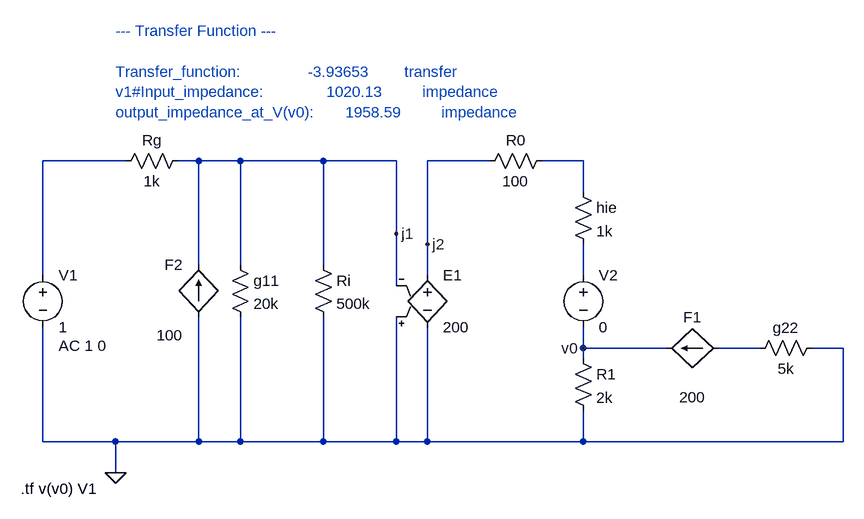
[diagram p0: schematic eje2_sim.asc]
eje2_sim.asc, the LTspice schematic file:
Version 4
SHEET 1 888 696
WIRE -240 176 -368 176
WIRE -128 176 -160 176
WIRE -64 176 -128 176
WIRE 64 176 -64 176
WIRE 176 176 64 176
WIRE 320 176 224 176
WIRE 464 176 400 176
WIRE 464 224 464 176
WIRE 176 288 176 176
WIRE 224 304 224 176
WIRE -128 336 -128 176
WIRE -64 336 -64 176
WIRE 64 336 64 176
WIRE -368 352 -368 176
WIRE 224 352 224 304
WIRE 464 352 464 304
WIRE 176 368 176 288
WIRE 464 464 464 432
WIRE 592 464 464 464
WIRE 736 464 672 464
WIRE 864 464 816 464
WIRE 464 480 464 464
WIRE -368 608 -368 432
WIRE -256 608 -368 608
WIRE -128 608 -128 416
WIRE -128 608 -256 608
WIRE -64 608 -64 416
WIRE -64 608 -128 608
WIRE 64 608 64 416
WIRE 64 608 -64 608
WIRE 176 608 176 416
WIRE 176 608 64 608
WIRE 224 608 224 432
WIRE 224 608 176 608
WIRE 464 608 464 560
WIRE 464 608 224 608
WIRE 864 608 864 464
WIRE 864 608 464 608
WIRE -256 656 -256 608
FLAG -256 656 0
FLAG 464 464 v0
FLAG 176 288 j1
FLAG 224 304 j2
SYMBOL res -144 160 R90
WINDOW 0 0 56 VBottom 2
WINDOW 3 32 56 VTop 2
SYMATTR InstName Rg
SYMATTR Value 1k
SYMBOL res -80 320 R0
SYMATTR InstName g11
SYMATTR Value 20k
SYMBOL res 48 320 R0
SYMATTR InstName Ri
SYMATTR Value 500k
SYMBOL res 416 160 R90
WINDOW 0 0 56 VBottom 2
WINDOW 3 32 56 VTop 2
SYMATTR InstName R0
SYMATTR Value 100
SYMBOL res 720 480 R270
WINDOW 0 32 56 VTop 2
WINDOW 3 0 56 VBottom 2
SYMATTR InstName g22
SYMATTR Value 5k
SYMBOL res 448 208 R0
SYMATTR InstName hie
SYMATTR Value 1k
SYMBOL voltage 464 336 R0
WINDOW 123 0 0 Left 0
WINDOW 39 0 0 Left 0
SYMATTR InstName V2
SYMATTR Value 0
SYMBOL res 448 464 R0
SYMATTR InstName R1
SYMATTR Value 2k
SYMBOL f 672 464 R90
WINDOW 0 -32 40 VBottom 2
WINDOW 3 32 40 Invisible 2
WINDOW 123 60 40 VTop 2
SYMATTR InstName F1
SYMATTR Value V2
SYMATTR Value2 200
SYMBOL e2 224 336 R0
SYMATTR InstName E1
SYMATTR Value 200
SYMBOL voltage -368 336 R0
WINDOW 123 24 124 Left 2
WINDOW 39 0 0 Left 0
SYMATTR InstName V1
SYMATTR Value 1
SYMATTR Value2 AC 1 0
SYMBOL f -128 416 R180
WINDOW 0 24 80 Left 2
WINDOW 3 24 0 Invisible 2
WINDOW 123 24 -28 Left 2
SYMATTR InstName F2
SYMATTR Value V2
SYMATTR Value2 100
TEXT -402 680 Left 2 !.tf v(v0) V1
TEXT -256 -24 Left 2 ;--- Transfer Function ---\n \nTransfer_function:               -3.93653        transfer\nv1#Input_impedance:              1020.13         impedance\noutput_impedance_at_V(v0):       1958.59         impedance

The netlist it stands for:
* eje2_sim.asc
Rg j1 N001 1k
R§g11 j1 0 20k
Ri j1 0 500k
R0 N002 j2 100
R§g22 N004 0 5k
R§hie N002 N003 1k
V2 N003 v0 0
R1 v0 0 2k
F1 N004 v0 V2 200
E1 j2 0 0 j1 200
V1 N001 0 1 AC 1 0
F2 0 j1 V2 100
.tf v(v0) V1
* --- Transfer Function ---
* Transfer_function:               -3.93653        transfer
* v1#Input_impedance:              1020.13         impedance
* output_impedance_at_V(v0):       1958.59         impedance
.backanno
.end